# EAGLE design transmitter (EAGLE 5.10)
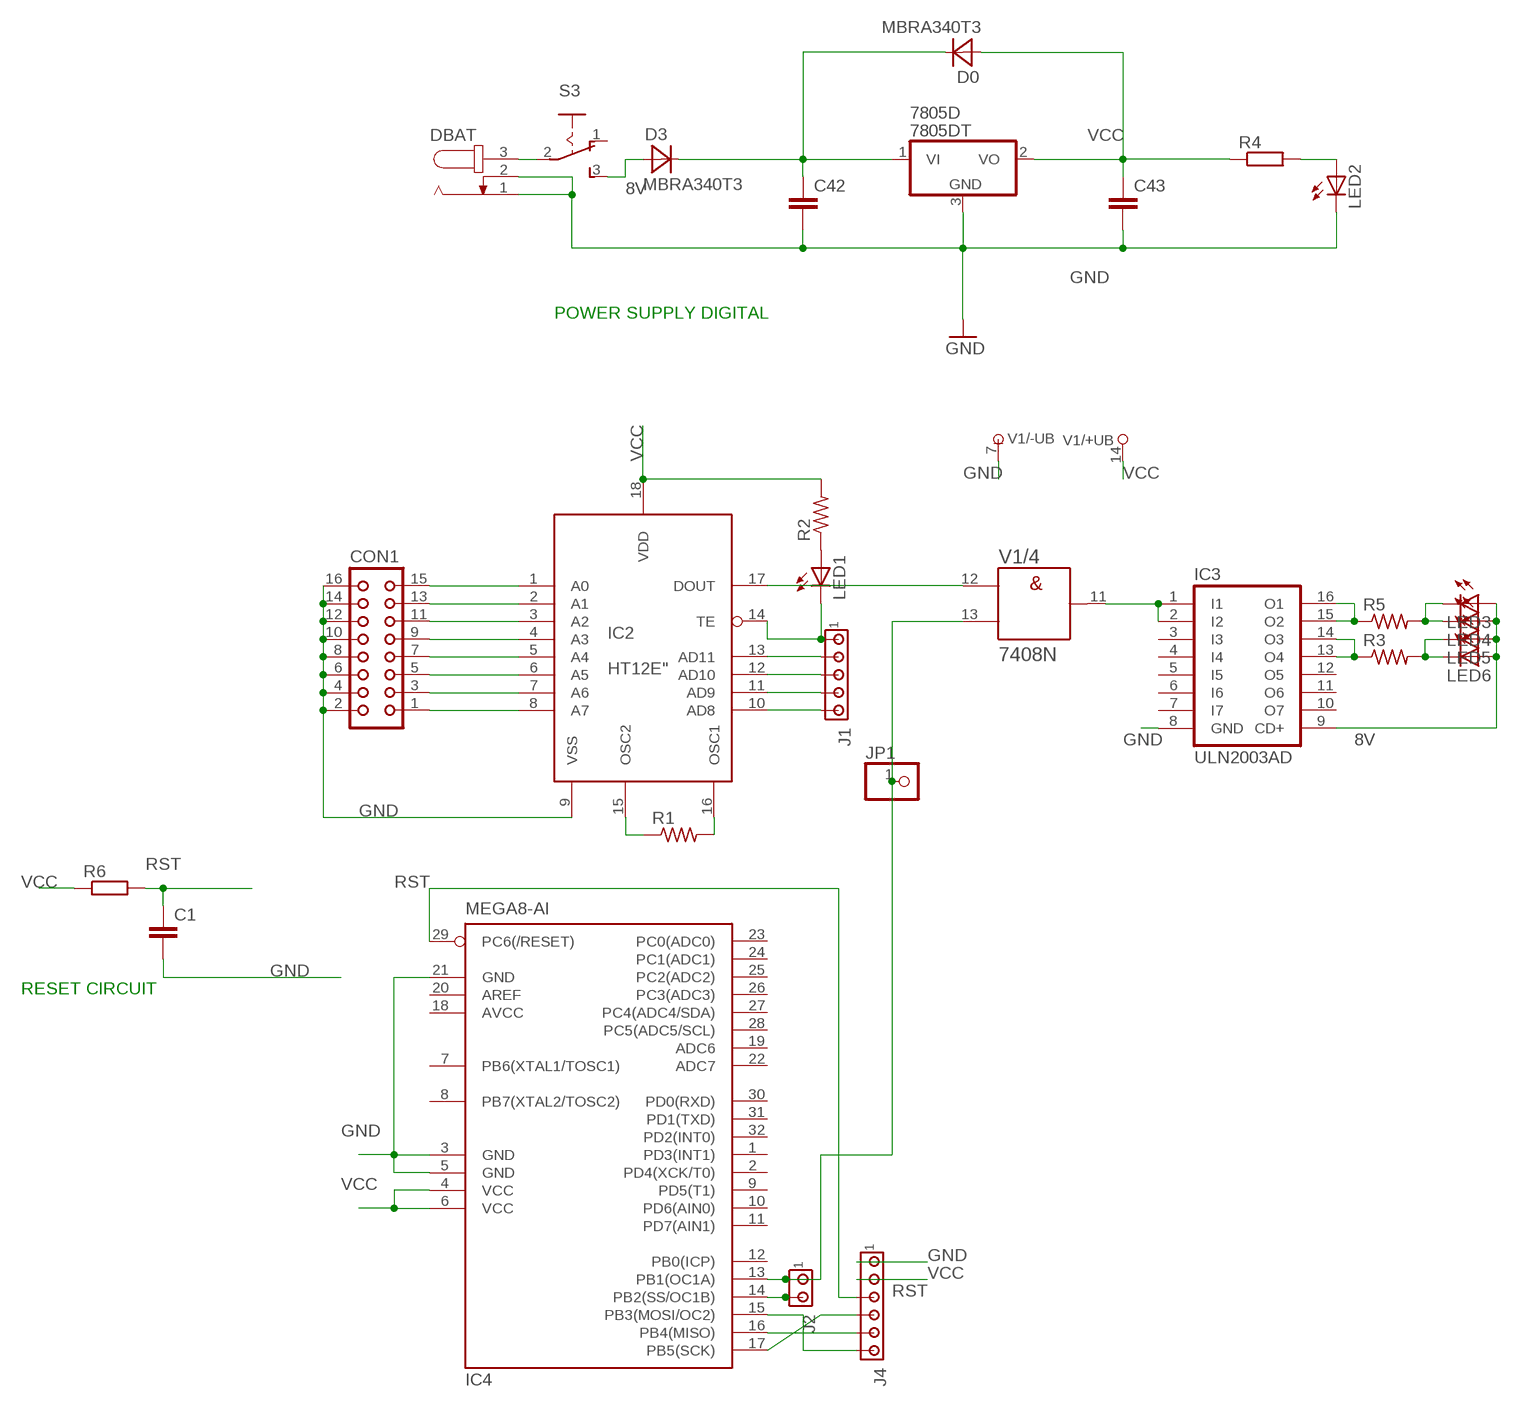
[diagram p0: schematic, sheet 1]

## Parts
7805D  7805DT  [TO252]
C1  C-EUC0603  [C0603]
C42  C-EUC0603  [C0603]
C43  C-EUC0603  [C0603]
CON1  CON16  [CON16]
D0  MBRA340T3  [SMA]
D3  MBRA340T3  [SMA]
DBAT  JACK-PLUG0  [SPC4077]
IC2  HT12E"  [18-DIP-A]
IC3  ULN2003AD  [SO16]
IC4  MEGA8-AI  [TQFP32-08]
J1  MTA05-100  [10X05MTA]
J2  MTA02-100  [10X02MTA]
J4  MTA06-100  [10X06MTA]
JP1  PINHD-1X1  [1X01]
LED1  LED3MM  [LED3MM]
LED2  LED3MM  [LED3MM]
LED3  LED5MM  [LED5MM]
LED4  LED5MM  [LED5MM]
LED5  LED5MM  [LED5MM]
LED6  LED5MM  [LED5MM]
R1  R-US_VMTA55  [VMTA55]
R2  R-US_M1206  [M1206]
R3  R-US_0309/12  [0309/12]
R4  R-EU_R0603  [R0603]
R5  R-US_0309/12  [0309/12]
R6  R-EU_R0603  [R0603]
S3  255SB  [255SB]
V1  7408N  [DIL14]

## Nets
8V: D3.A IC3.9(CD+) LED3.A LED4.A LED5.A LED6.A S3.3(S)
GND: 7805D.3(GND) C1.2 C42.2 C43.2 CON1.2 CON1.4 CON1.6 CON1.8 CON1.10 CON1.12 CON1.14 CON1.16 DBAT.1 DBAT.2 IC2.9(VSS) IC3.8(GND) IC4.3(GND) IC4.5(GND) IC4.21(GND) J4.6 LED2.K(C) V1.7(/-UB:-UB)
N$1: CON1.15 IC2.1(A0)
N$2: CON1.13 IC2.2(A1)
N$3: CON1.11 IC2.3(A2)
N$4: CON1.9 IC2.4(A3)
N$5: CON1.7 IC2.5(A4)
N$6: DBAT.3 S3.2(P)
N$7: IC3.15(O2) IC3.16(O1) R5.1
N$8: LED2.A R4.2
N$9: CON1.5 IC2.6(A5)
N$10: CON1.3 IC2.7(A6)
N$11: CON1.1 IC2.8(A7)
N$12: IC2.13(AD11) J1.2
N$13: IC2.12(AD10) J1.3
N$14: IC2.11(AD9) J1.4
N$15: IC2.10(AD8) J1.5
N$16: IC2.16(OSC1) R1.2
N$17: IC2.15(OSC2) R1.1
N$18: IC4.13(PB1(OC1A)) J2.1 JP1.1 V1.13(/4:B)
N$19: IC4.14(PB2(SS/OC1B)) J2.2
N$20: IC3.13(O4) IC3.14(O3) R3.1
N$21: LED5.K(C) LED6.K(C) R3.2
N$22: IC2.17(DOUT) V1.12(/4:A)
N$24: LED1.A R2.1
N$25: IC3.1(I1) IC3.2(I2) V1.11(/4:Y)
N$26: IC4.15(PB3(MOSI/OC2)) J4.1
N$27: LED3.K(C) LED4.K(C) R5.2
N$28: IC4.16(PB4(MISO)) J4.2
N$29: IC4.17(PB5(SCK)) J4.3
RST: C1.1 IC4.29(PC6(/RESET)) J4.4 R6.2
TE: IC2.14(TE) J1.1 LED1.K(C)
VCC: 7805D.2(VO) C43.1 D0.A IC2.18(VDD) IC4.4(VCC) IC4.6(VCC) J4.5 R2.2 R4.1 R6.1 V1.14(/+UB:+UB)
VI(5D): 7805D.1(VI) C42.1 D0.C D3.C
Unconnected: IC3.3(I3) IC3.4(I4) IC3.5(I5) IC3.6(I6) IC3.7(I7) IC3.10(O7) IC3.11(O6) IC3.12(O5) IC4.1(PD3(INT1)) IC4.2(PD4(XCK/T0)) IC4.7(PB6(XTAL1/TOSC1)) IC4.8(PB7(XTAL2/TOSC2)) IC4.9(PD5(T1)) IC4.10(PD6(AIN0)) IC4.11(PD7(AIN1)) IC4.12(PB0(ICP)) IC4.19(ADC6) IC4.20(AREF) IC4.22(ADC7) IC4.23(PC0(ADC0)) IC4.24(PC1(ADC1)) IC4.25(PC2(ADC2)) IC4.26(PC3(ADC3)) IC4.27(PC4(ADC4/SDA)) IC4.28(PC5(ADC5/SCL)) IC4.30(PD0(RXD)) IC4.31(PD1(TXD)) IC4.32(PD2(INT0)) S3.1(O) V1.1(/1:A) V1.2(/1:B) V1.3(/1:Y) V1.4(/2:A) V1.5(/2:B) V1.6(/2:Y) V1.8(/3:Y) V1.9(/3:A) V1.10(/3:B)

## Notes on the sheet
- POWER SUPPLY DIGITAL
- RESET CIRCUIT

## Power pins joined to a net without a drawn wire
AVCC: IC4.18(AVCC)

## Library data of the parts
7805D = linear:78*: Positive VOLTAGE REGULATOR Source: http://cache.national.com/ds/LM/LM78L05.pdf http://www.fairchildsemi.com/ds/LM/LM7805.pdf
C1 C42 C43 = rcl:C-EU: CAPACITOR, European symbol
CON1 = con-harting:CON16: CONNECTOR
D0 D3 = diode:MBRA340T3: Surface Mount Schottky Power Rectifier Source: http://www.onsemi.com/pub_link/Collateral/MBRA340T3-D.PDF
DBAT = con-jack:JACK-PLUG: DC POWER JACK Power Jack, DC, Right Angle, Through Hole, Rated 5A at 16VDC, PC Terminals Distributor: Farnell (www.Farnell.de) Drawing: 84N1161.pdf / 84N1162.pdf Manufacturer: SPC Technology (www.spctechnology.com) Type: SPC4077 / SPC 4078
IC2 = holtek (2):HT12E: transmitter = encoder ic
IC3 = uln-udn:ULN2003A: DRIVER ARRAY
IC4 = atmel:MEGA8: MICROCONTROLLER 8 Kbytes FLASH, 1 kbytes SRAM, 512 bytes EEPROM, USART, 6-channel 10 bit ADC, 2-channel 8 bit ADC Pin compatible with Atmega48, ATMega88, ATMega168 Source: avr.lbr
J1 = con-amp:MTA05-100: AMP connector
J2 = con-amp:MTA02-100: AMP connector
J4 = con-amp:MTA06-100: AMP connector
JP1 = pinhead:PINHD-1X1: PIN HEADER
LED1-LED6 = led:LED: LED OSRAM: - CHIPLED LG R971, LG N971, LY N971, LG Q971, LY Q971, LO R971, LY R971 LH N974, LH R974 LS Q976, LO Q976, LY Q976 LO Q996 - Hyper CHIPLED LW Q18S LB Q993, LB Q99A, LB R99A - SideLED LS A670, LO A670, LY A670, LG A670, LP A670 LB A673, LV A673, LT A673, LW A673 LH A674 LY A675 LS A676, LA A676, LO A676, LY A676, LW A676 LS A679, LY A679, LG A679 - Hyper Micro SIDELED® LS Y876, LA Y876, LO Y876, LY Y876 LT Y87S - SmartLED LW L88C, LW L88S LB L89C, LB L89S, LG L890 LS L89K, LO L89K, LY L89K LS L896, LA L896, LO L896, LY L896 - TOPLED LS T670, LO T670, LY T670, LG T670, LP T670 LSG T670, LSP T670, LSY T670, LOP T670, LYG T670 LG T671, LOG T671, LSG T671 LB T673, LV T673, LT T673, LW T673 LH T674 LS T676, LA T676, LO T676, LY T676, LB T676, LH T676, LSB T676, LW T676 LB T67C, LV T67C, LT T67C, LS T67K, LO T67K, LY T67K, LW E67C LS E67B, LA E67B, LO E67B, LY E67B, LB E67C, LV E67C, LT E67C LW T67C LS T679, LY T679, LG T679 LS T770, LO T770, LY T770, LG T770, LP T770 LB T773, LV T773, LT T773, LW T773 LH T774 LS E675, LA E675, LY E675, LS T675 LS T776, LA T776, LO T776, LY T776, LB T776 LHGB T686 LT T68C, LB T68C - Hyper Mini TOPLED® LB M676 - Mini TOPLED Santana® LG M470 LS M47K, LO M47K, LY M47K Source: http://www.osram.convergy.de LUXEON: - LUMILED® LXK2-PW12-R00, LXK2-PW12-S00, LXK2-PW14-U00, LXK2-PW14-V00 LXK2-PM12-R00, LXK2-PM12-S00, LXK2-PM14-U00 LXK2-PE12-Q00, LXK2-PE12-R00, LXK2-PE12-S00, LXK2-PE14-T00, LXK2-PE14-U00 LXK2-PB12-K00, LXK2-PB12-L00, LXK2-PB12-M00, LXK2-PB14-N00, LXK2-PB14-P00, LXK2-PB14-Q00 LXK2-PR12-L00, LXK2-PR12-M00, LXK2-PR14-Q00, LXK2-PR14-R00 LXK2-PD12-Q00, LXK2-PD12-R00, LXK2-PD12-S00 LXK2-PH12-R00, LXK2-PH12-S00 LXK2-PL12-P00, LXK2-PL12-Q00, LXK2-PL12-R00 Source: www.luxeon.com KINGBRIGHT: KA-3528ASYC Source: www.kingbright.com
R1-R3 R5 = rcl:R-US_: RESISTOR, American symbol
R4 R6 = resistor:R-EU_: RESISTOR, European symbol
S3 = switch:255SB: SLIDING SWITCH Distributor Buerklin, 11G810
V1 = 74ttl-din:74*08: Quad 2-input AND gate

## Board
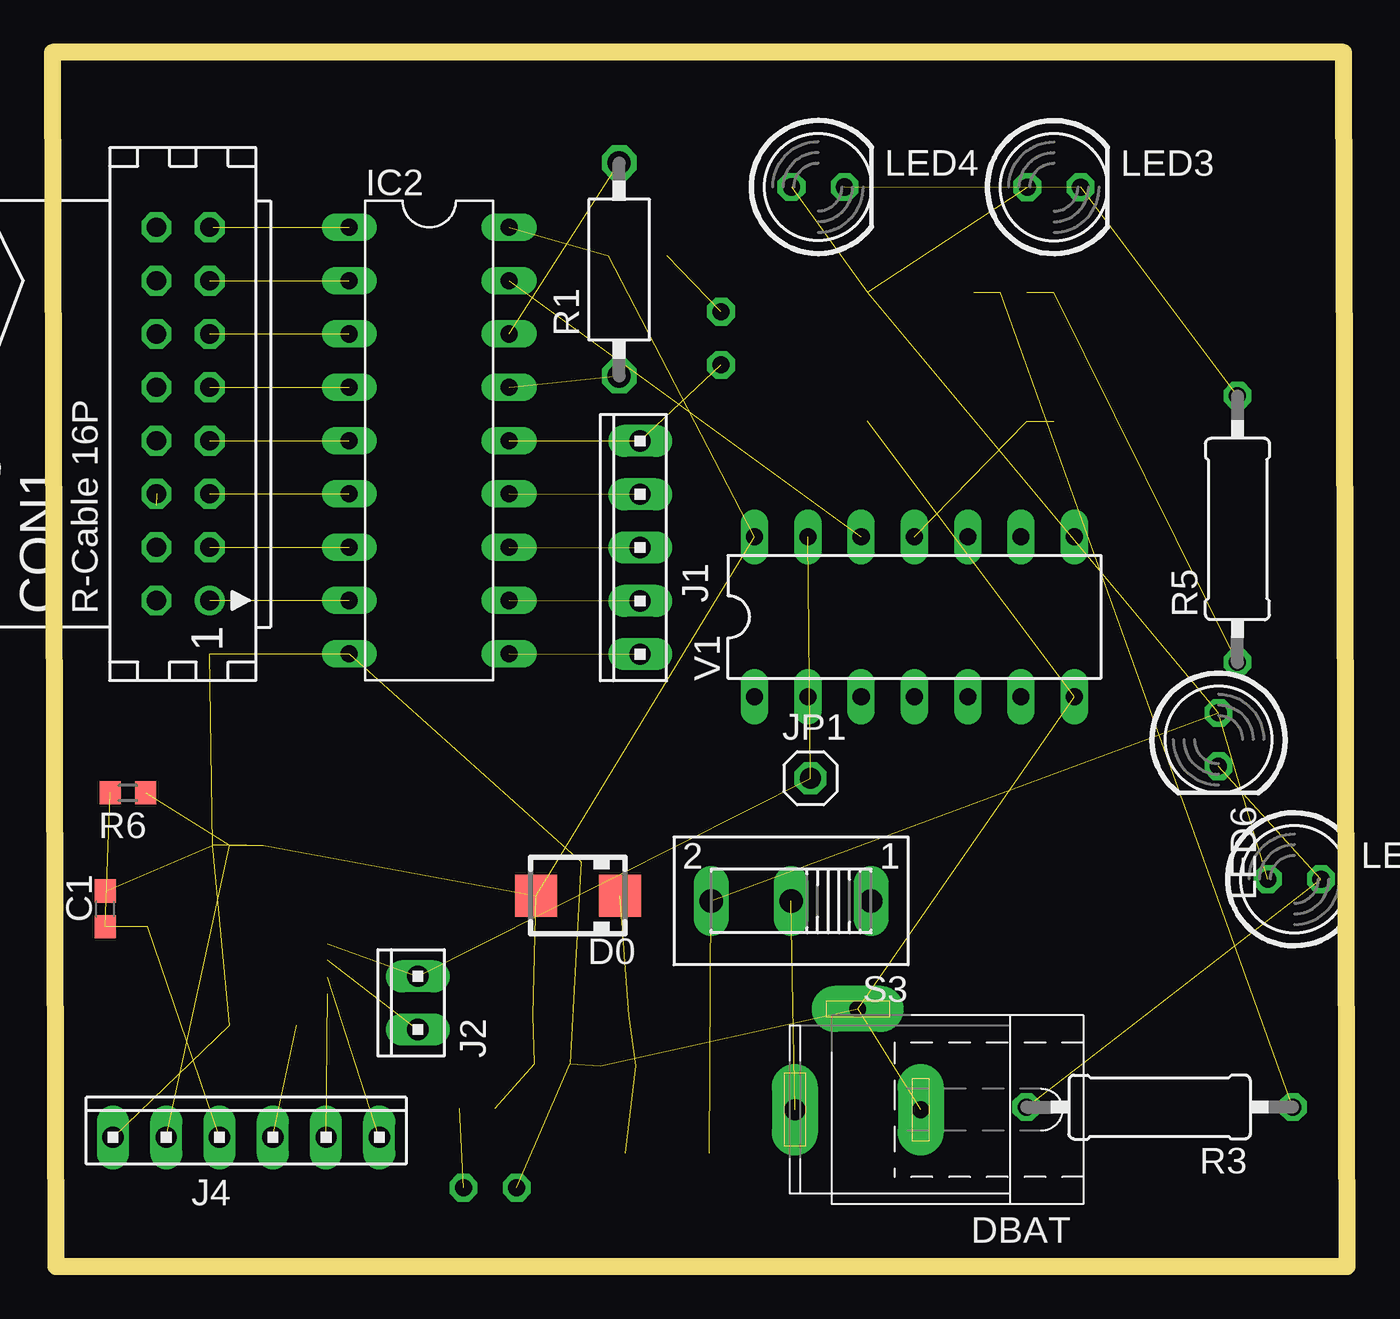
[diagram p1: board, top side]
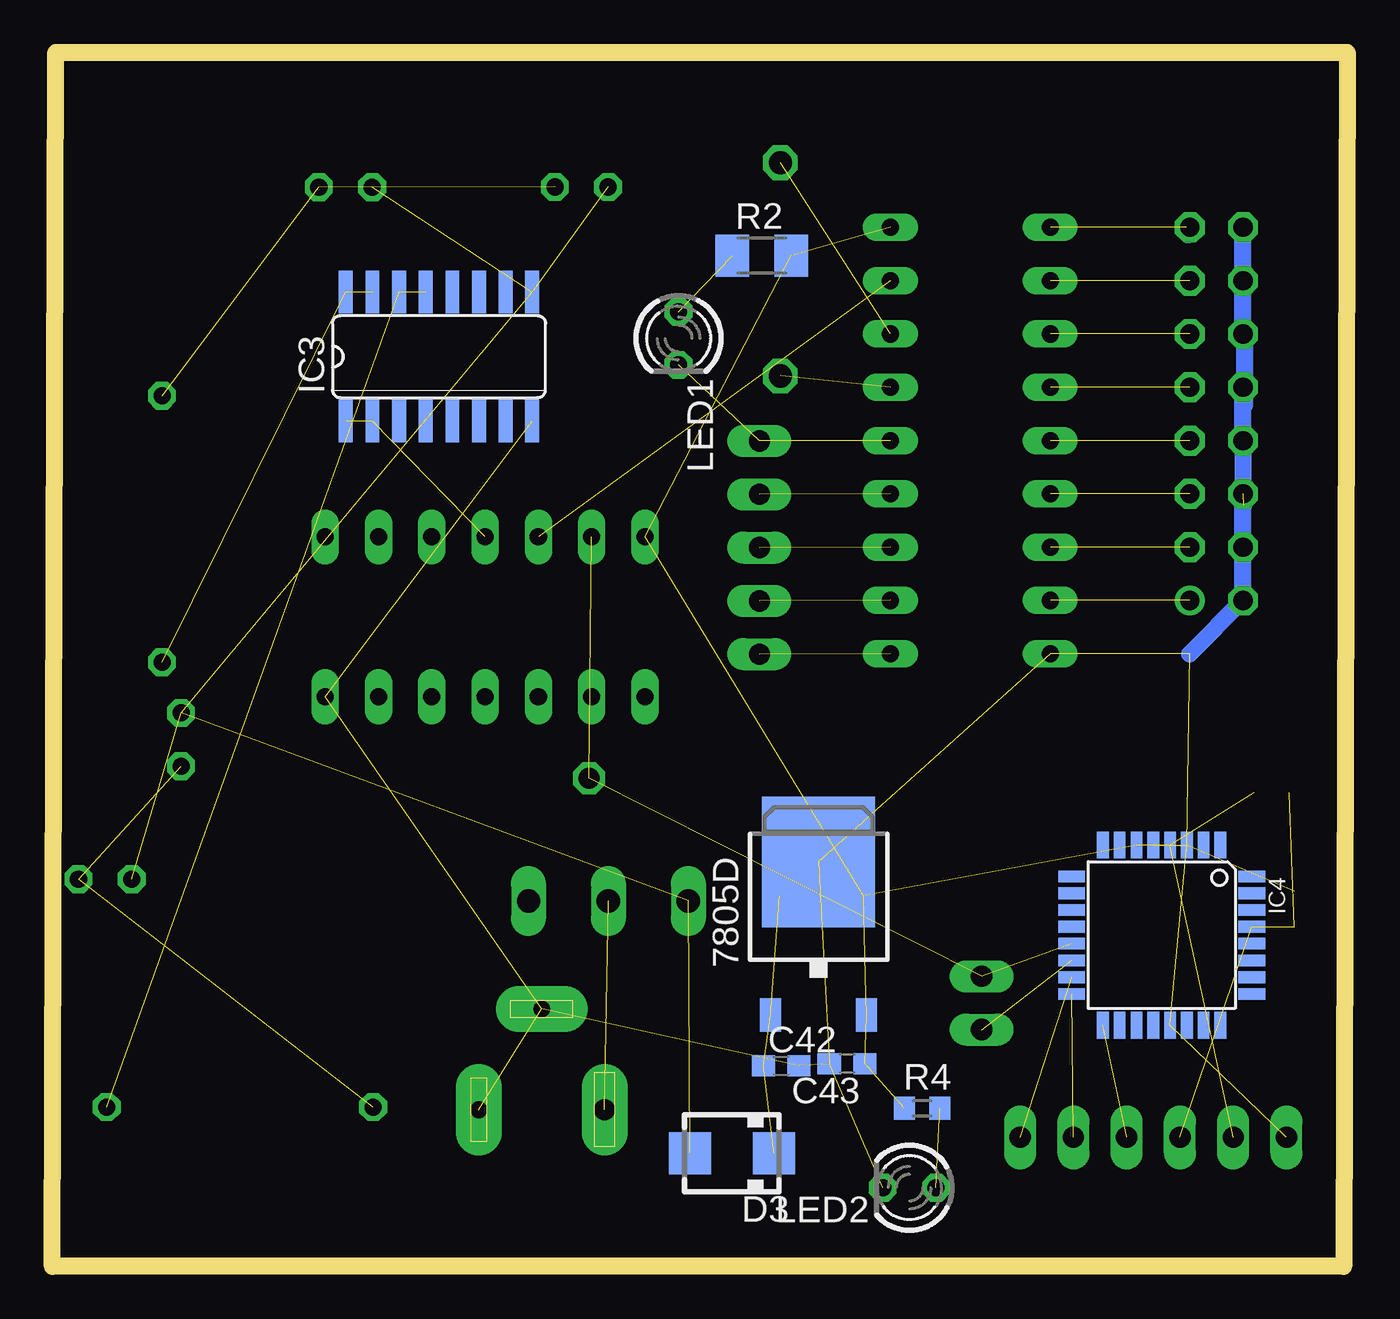
[diagram p2: board, bottom side, seen from below]

Size 61.72 x 57.85 mm. Coordinates in mm from the lower left corner, seen from the top.
Outline: 0.16,0 61.72,0 61.56,57.85 0,57.85 0.16,0
Copper layers (1*16): Top 0.035mm / dielectric 1.5mm / Bottom 0.035mm
Design rules "default": minimum track width 10mil, minimum drill 24mil, track to track 8mil, track to pad 8mil, pad to pad 8mil, via to via 8mil, smd to smd 8mil, copper to edge 40mil, drill to drill 8mil, minimum pad ring 10mil, minimum via ring 8mil, stop-mask expansion 4mil, vias tented up to drill 0mil, thermal gap 10mil

### Footprints (pad centres in the part's own frame; a part is rotated, then mirrored left to right if it is on the bottom)
TO252 = smd 1 x 1.6: 1 -2.28,-4.8; 2 2.28,-4.8 | smd 5.4 x 6.2: 3 0,2.5
C0603 = smd 1.1 x 1: 1 -0.85,0; 2 0.85,0
CON16 = drill 0.914 round: 1 -8.89,-1.27 | drill 0.914 octagon: 2 -8.89,1.27; 3 -6.35,-1.27; 4 -6.35,1.27; 5 -3.81,-1.27; 6 -3.81,1.27; 7 -1.27,-1.27; 8 -1.27,1.27; 9 1.27,-1.27; 10 1.27,1.27; 11 3.81,-1.27; 12 3.81,1.27; 13 6.35,-1.27; 14 6.35,1.27; 15 8.89,-1.27; 16 8.89,1.27
SMA = smd 2 x 2: A 2,0; C -2,0
SPC4077 = drill 0.8 pad 2.184 long: 1 -3,0; 2 0,-4.8 | drill 1 pad 2.184 long: 3 3,0
18-DIP-A = drill 0.813 long: 1 -10.16,-3.81; 2 -7.62,-3.81; 3 -5.08,-3.81; 4 -2.54,-3.81; 5 0,-3.81; 6 2.54,-3.81; 7 5.08,-3.81; 8 7.62,-3.81; 9 10.16,-3.81; 10 10.16,3.81; 11 7.62,3.81; 12 5.08,3.81; 13 2.54,3.81; 14 0,3.81; 15 -2.54,3.81; 16 -5.08,3.81; 17 -7.62,3.81; 18 -10.16,3.81
SO16 = smd 0.66 x 2.032: 1 -4.445,-3.073; 2 -3.175,-3.073; 3 -1.905,-3.073; 4 -0.635,-3.073; 5 0.635,-3.073; 6 1.905,-3.073; 7 3.175,-3.073; 8 4.445,-3.073; 9 4.445,3.073; 10 3.175,3.073; 11 1.905,3.073; 12 0.635,3.073; 13 -0.635,3.073; 14 -1.905,3.073; 15 -3.175,3.073; 16 -4.445,3.073
TQFP32-08 = smd 1.27 x 0.559: 1 -4.293,2.8; 2 -4.293,2; 3 -4.293,1.2; 4 -4.293,0.4; 5 -4.293,-0.4; 6 -4.293,-1.2; 7 -4.293,-2; 8 -4.293,-2.8; 17 4.293,-2.8; 18 4.293,-2; 19 4.293,-1.2; 20 4.293,-0.4; 21 4.293,0.4; 22 4.293,1.2; 23 4.293,2; 24 4.293,2.8 | smd 0.559 x 1.27: 9 -2.8,-4.293; 10 -2,-4.293; 11 -1.2,-4.293; 12 -0.4,-4.293; 13 0.4,-4.293; 14 1.2,-4.293; 15 2,-4.293; 16 2.8,-4.293; 25 2.8,4.293; 26 2,4.293; 27 1.2,4.293; 28 0.4,4.293; 29 -0.4,4.293; 30 -1.2,4.293; 31 -2,4.293; 32 -2.8,4.293
10X05MTA = drill 1.016 long: 1 5.08,0; 2 2.54,0; 3 0,0; 4 -2.54,0; 5 -5.08,0
10X02MTA = drill 1.016 long: 1 1.27,0; 2 -1.27,0
10X06MTA = drill 1.016 long: 1 6.35,0; 2 3.81,0; 3 1.27,0; 4 -1.27,0; 5 -3.81,0; 6 -6.35,0
1X01 = drill 1.016 octagon: 1 0,0
LED3MM = drill 0.813 octagon: A -1.27,0; K 1.27,0
LED5MM = drill 0.813 octagon: A -1.27,0; K 1.27,0
VMTA55 = drill 1.1 octagon: 1 -5.08,0; 2 5.08,0
M1206 = smd 1.6 x 2: 1 -1.4,0; 2 1.4,0
0309/12 = drill 0.813 octagon: 1 -6.35,0; 2 6.35,0
R0603 = smd 1 x 1.1: 1 -0.85,0; 2 0.85,0
255SB = drill 1.118 long: 1 -3.81,0; 2 0,0; 3 3.81,0
DIL14 = drill 0.813 long: 1 -7.62,-3.81; 2 -5.08,-3.81; 3 -2.54,-3.81; 4 0,-3.81; 5 2.54,-3.81; 6 5.08,-3.81; 7 7.62,-3.81; 8 7.62,3.81; 9 5.08,3.81; 10 2.54,3.81; 11 0,3.81; 12 -2.54,3.81; 13 -5.08,3.81; 14 -7.62,3.81

### Placement (x,y rotation side)
7805D  25.2,16.77 0 bottom
C1  2.52,17.04 90 top
C42  26.98,9.55 0 bottom
C43  23.84,9.66 180 bottom
CON1  6.23,40.62 90 top
D0  25.05,17.67 180 top
D3  29.33,5.39 180 bottom
DBAT  38.39,7.47 180 top
IC2  17.96,39.35 270 top
IC3  43.29,43.35 0 bottom
IC4  8.84,15.78 270 bottom
J1  28.01,34.25 90 top
J2  17.42,12.55 90 top
J4  9.24,6.15 0 top
JP1  36.13,23.26 0 top
LED1  31.87,44.23 270 bottom
LED2  20.86,3.75 180 bottom
LED3  47.75,51.43 0 top
LED4  36.5,51.44 0 top
LED5  59.21,18.45 0 top
LED6  55.59,25.1 270 top
R1  27.02,47.51 90 top
R2  27.9,48.17 0 bottom
R3  52.78,7.59 180 top
R4  20.26,7.53 0 bottom
R5  56.49,35.14 90 top
R6  3.6,22.56 180 top
S3  35.21,17.42 180 top
V1  41.09,30.95 0 top

### Tracks (layer width: path | path; a pad name or v marks a point on that pad's centre or on a via)
8V  (6 unrouted)
GND  (15 unrouted)
  Bottom 0.813: CON1.16 CON1.14 CON1.12 4.88,44.43 4.88,41.05 4.96,41.05 CON1.10 CON1.8 4.94,39.35 4.94,36.27 4.96,36.27 CON1.4 CON1.2 | CON1.2 4.9,31.73 | CON1.2 7.5,29.19
N$1  (1 unrouted)
  Bottom 0.406: 7.66,49.51 7.66,48.96 7.5,48.96 CON1.15
N$2  (1 unrouted)
N$3  (1 unrouted)
N$4  (1 unrouted)
N$5  (1 unrouted)
N$6  (1 unrouted)
N$7  (2 unrouted)
N$8  (1 unrouted)
N$9  (1 unrouted)
N$10  (1 unrouted)
N$11  (1 unrouted)
N$12  (1 unrouted)
N$13  (1 unrouted)
N$14  (1 unrouted)
N$15  (1 unrouted)
N$16  (1 unrouted)
N$17  (1 unrouted)
N$18  (3 unrouted)
N$19  (1 unrouted)
N$20  (2 unrouted)
N$21  (2 unrouted)
N$22  (1 unrouted)
N$24  (1 unrouted)
N$25  (2 unrouted)
N$26  (1 unrouted)
N$27  (2 unrouted)
N$28  (1 unrouted)
N$29  (1 unrouted)
RST  (3 unrouted)
TE  (2 unrouted)
VCC  (10 unrouted)
VI(5D)  (3 unrouted)